# EAGLE design ESP8266 (EAGLE 7.7.0)
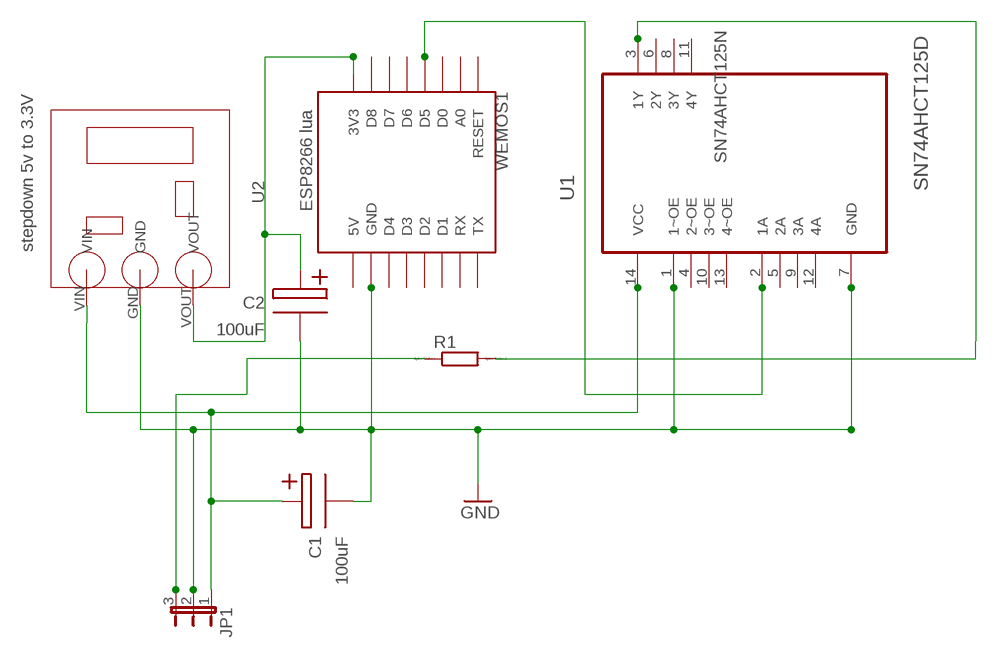
[diagram p0: schematic, sheet 1]

## Parts
C1  100uF  GEPOLTER_ELEKTROLYTKONDENSATOR  [GEPOLTER_ELEKTROLYTKONDENSATOR]
C2  100uF  GEPOLTER_ELEKTROLYTKONDENSATOR  [GEPOLTER_ELEKTROLYTKONDENSATOR]
JP1  JP2W  [JP2W]
R1  R0204/7  [0204/7]
U1  SN74AHCT125D  [SOIC127P600X175-14N]
U2  stepdown 5v to 3.3V  STEPDOWN  [STEPDOWN]
WEMOS1  ESP8266 lua  WEMOS-D1-MINI  [WEMOS-D1-MINI]

## Nets
5V: C1.+ JP1.1 U1.14(VCC) U2.VIN
DIN: U1.2(1A) WEMOS1.D5
DOUT: R1.2 U1.3(1Y)
GND: C1.- C2.- JP1.2 U1.1(1~OE) U1.7(GND) U2.GND WEMOS1.GND
SIGOUT(5V): JP1.3 R1.1
VOUT: C2.+ U2.VOUT WEMOS1.3V3
Unconnected: U1.4(2~OE) U1.5(2A) U1.6(2Y) U1.8(3Y) U1.9(3A) U1.10(3~OE) U1.11(4Y) U1.12(4A) U1.13(4~OE) WEMOS1.5V WEMOS1.A0 WEMOS1.D0 WEMOS1.D1 WEMOS1.D2 WEMOS1.D3 WEMOS1.D4 WEMOS1.D6 WEMOS1.D7 WEMOS1.D8 WEMOS1.RESET WEMOS1.RX WEMOS1.TX

## Library data of the parts
C1 C2 = e-kondensatoren:GEPOLTER_ELEKTROLYTKONDENSATOR: Gepolter Elektrolytkondensator
JP1 = jumper:JP2W: JUMPER
R1 = eagle-ltspice:R: RESISTOR, European symbol; SPICEMODEL: NONE; SPICEPREFIX: R
U1 = Texas Instruments_By_element14_Batch_1:SN74AHCT125D: QUADRUPLE BUS BUFFER GATES WITH 3-STATE OUTPUTS; MPN: SN74AHCT125N; OC_FARNELL: 1287453; OC_NEWARK: 76C1498; PACKAGE: SOIC-14; SUPPLIER: Texas Instruments
U2 = stepdown:STEPDOWN: 5 t03,3v controler based on LM2574
WEMOS1 = esp8266modules:WEMOS-D1-MINI: WeMos.cc D1 mini ESP8266 module

## Board
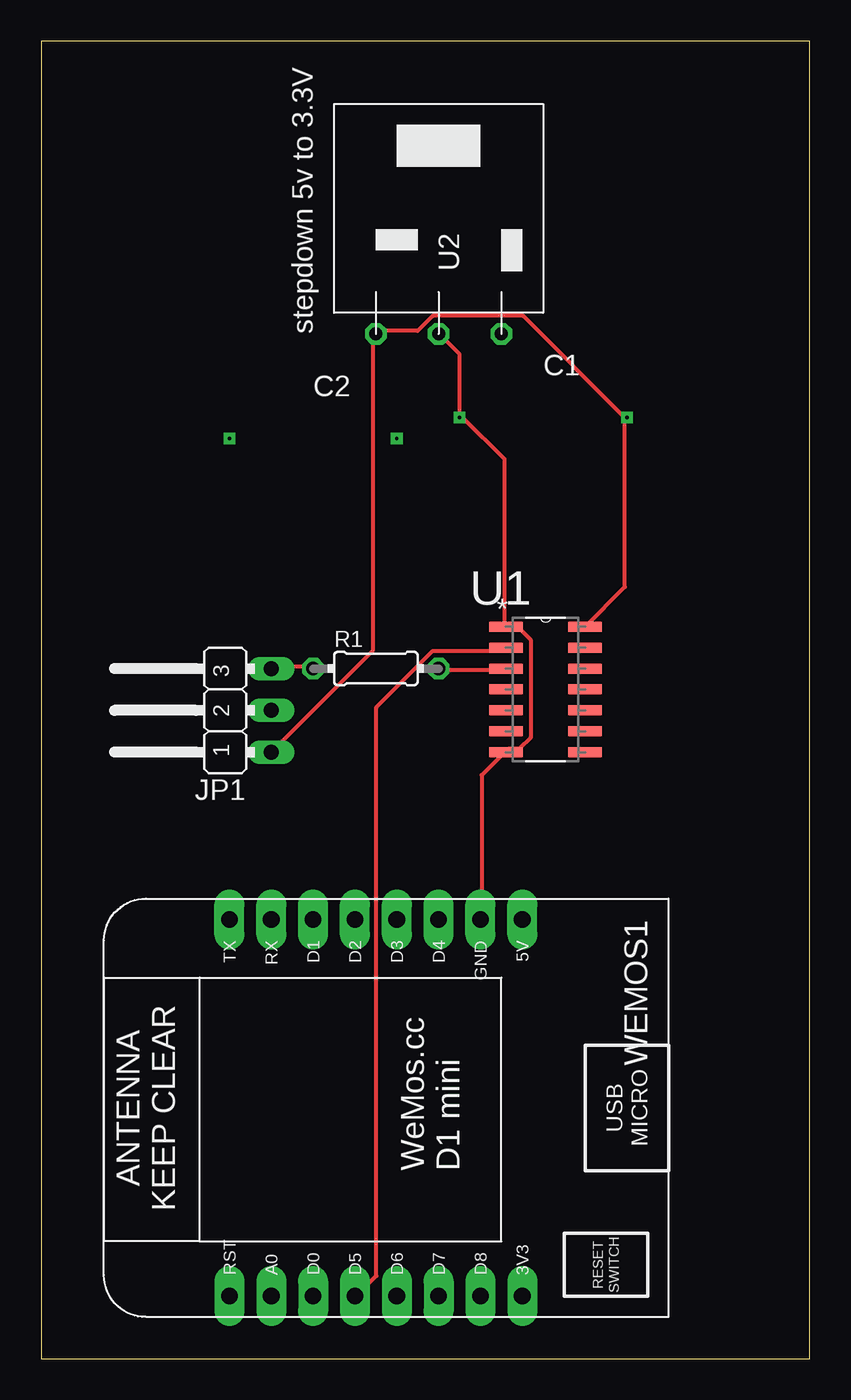
[diagram p1: board, top side]
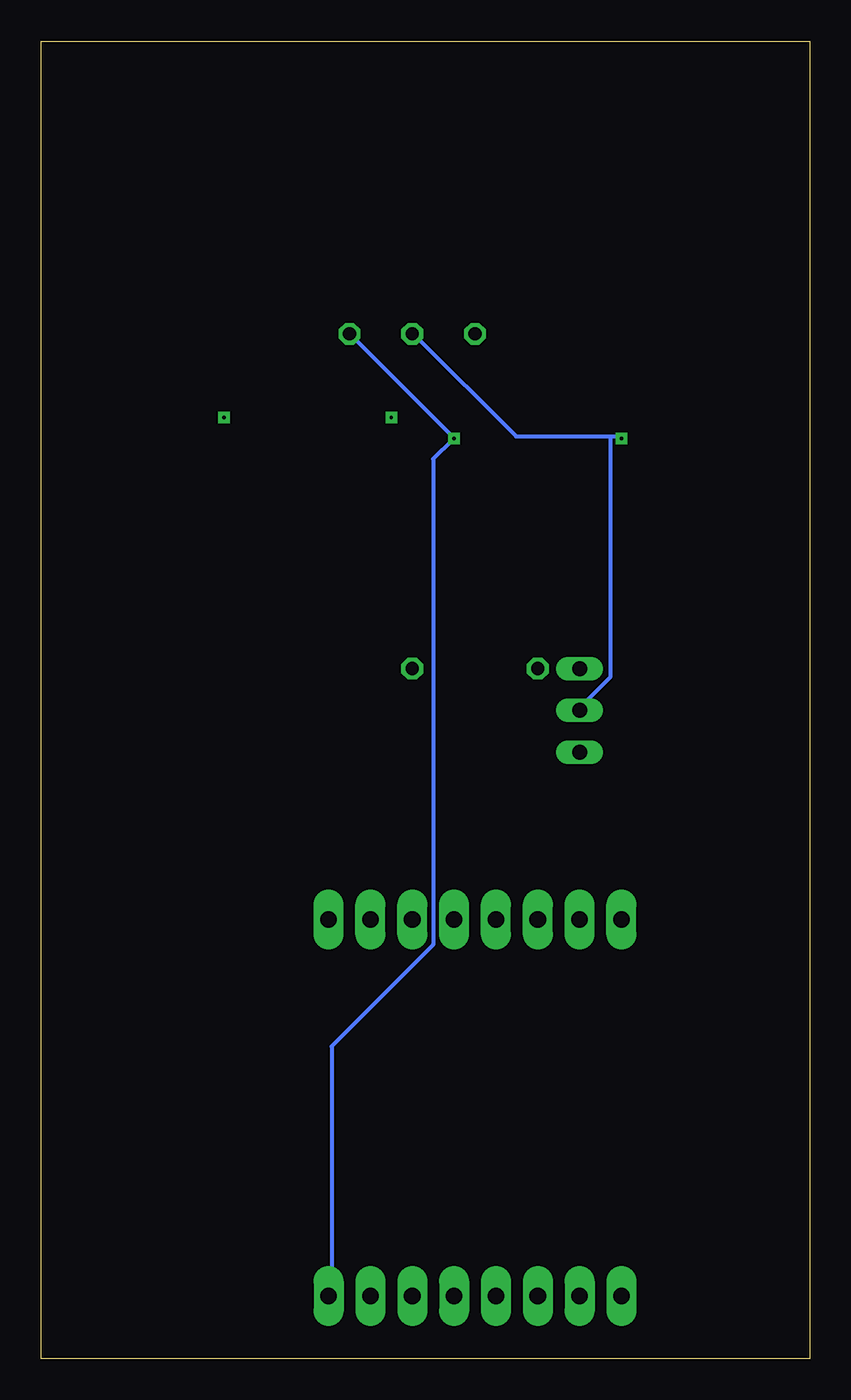
[diagram p2: board, bottom side, seen from below]

Size 46.66 x 80 mm. Coordinates in mm from the lower left corner, seen from the top.
Outline: 0,0 46.66,0 46.66,80 0,80 0,0
Copper layers (1*16): Top 0.035mm / dielectric 1.5mm / Bottom 0.035mm
Design rules "default": minimum track width 10mil, minimum drill 24mil, track to track 8mil, track to pad 8mil, pad to pad 8mil, via to via 8mil, smd to smd 8mil, copper to edge 40mil, drill to drill 8mil, minimum pad ring 10mil, minimum via ring 8mil, stop-mask expansion 4mil, vias tented up to drill 0mil, thermal gap 10mil

### Footprints (pad centres in the part's own frame; a part is rotated, then mirrored left to right if it is on the bottom)
GEPOLTER_ELEKTROLYTKONDENSATOR = drill 0.2 pad 0.6 square: + 5.08,0; - -5.08,0
JP2W = drill 0.914 long: 1 -2.54,-1.27; 2 0,-1.27; 3 2.54,-1.27
0204/7 = drill 0.813 octagon: 1 -3.81,0; 2 3.81,0
SOIC127P600X175-14N = smd 2.057 x 0.61: 1 -4.801,7.62; 2 -4.801,6.35; 3 -4.801,5.08; 4 -4.801,3.81; 5 -4.801,2.54; 6 -4.801,1.27; 7 -4.801,0; 8 0,0; 9 0,1.27; 10 0,2.54; 11 0,3.81; 12 0,5.08; 13 0,6.35; 14 0,7.62
STEPDOWN = drill 0.8 pad 1.27 octagon: GND 0,-8.89; VIN -3.81,-8.89; VOUT 3.81,-8.89
WEMOS-D1-MINI = drill 1.016 pad 1.829 long: 3V3 -10.16,-10.16; 5V 12.7,-10.16; A0 -10.16,5.08; D0 -10.16,2.54; D1 12.7,2.54; D2 12.7,0; D3 12.7,-2.54; D4 12.7,-5.08; D5 -10.16,0; D6 -10.16,-2.54; D7 -10.16,-5.08; D8 -10.16,-7.62; GND 12.7,-7.62; RESET -10.16,7.62; RX 12.7,5.08; TX 12.7,7.62

### Placement (x,y rotation side)
C1  30.48,57.15 0 top
C2  16.51,55.88 0 top
JP1  12.7,39.37 90 top
R1  20.32,41.91 0 top
U1  33.02,36.83 0 top
U2  24.13,71.12 0 top
WEMOS1  19.05,13.97 90 top

### Tracks (layer width: path | path; a pad name or v marks a point on that pad's centre or on a via)
5V
  Top 0.254: 35.43,57.15 35.43,46.86 U1.14 | 35.43,57.15 29.26,63.32 23.77,63.32 22.86,62.41 20.34,62.41 U2.VIN 20.12,62.18 20.12,42.98 JP1.1 | 35.43,57.15 C1.+
DIN
  Top 0.254: U1.2 28.12,42.98 23.77,42.98 20.34,39.55 20.34,5.03 19.2,3.89 WEMOS1.D5
DOUT
  Top 0.254: U1.3 28.12,41.83 24.23,41.83 R1.2
GND
  Top 0.254: WEMOS1.GND 26.75,26.75 26.75,35.43 28.12,36.8 U1.7 28.35,37.03 29.03,37.03 29.72,37.72 29.72,43.66 29.03,44.35 28.35,44.35 U1.1 28.12,44.58 28.12,54.63 25.6,57.15 C1.- 25.38,57.15 25.38,61.04 24.23,62.18 U2.GND
  Bottom 0.254: 12.12,56.01 17.83,56.01 24,62.18 U2.GND | 12.12,56.01 11.43,56.01 C2.- | 12.12,56.01 12.12,41.38 13.95,39.55 JP1.2
SIGOUT(5V)
  Top 0.254: R1.1 16.46,42.06 14.17,42.06 JP1.3
VOUT
  Bottom 0.254: U2.VOUT C2.+ 21.72,55.78 22.86,54.63 22.86,25.15 29.03,18.97 29.03,3.89 WEMOS1.3V3